# Altium schematic sheet park-contor.SchDoc
size A3
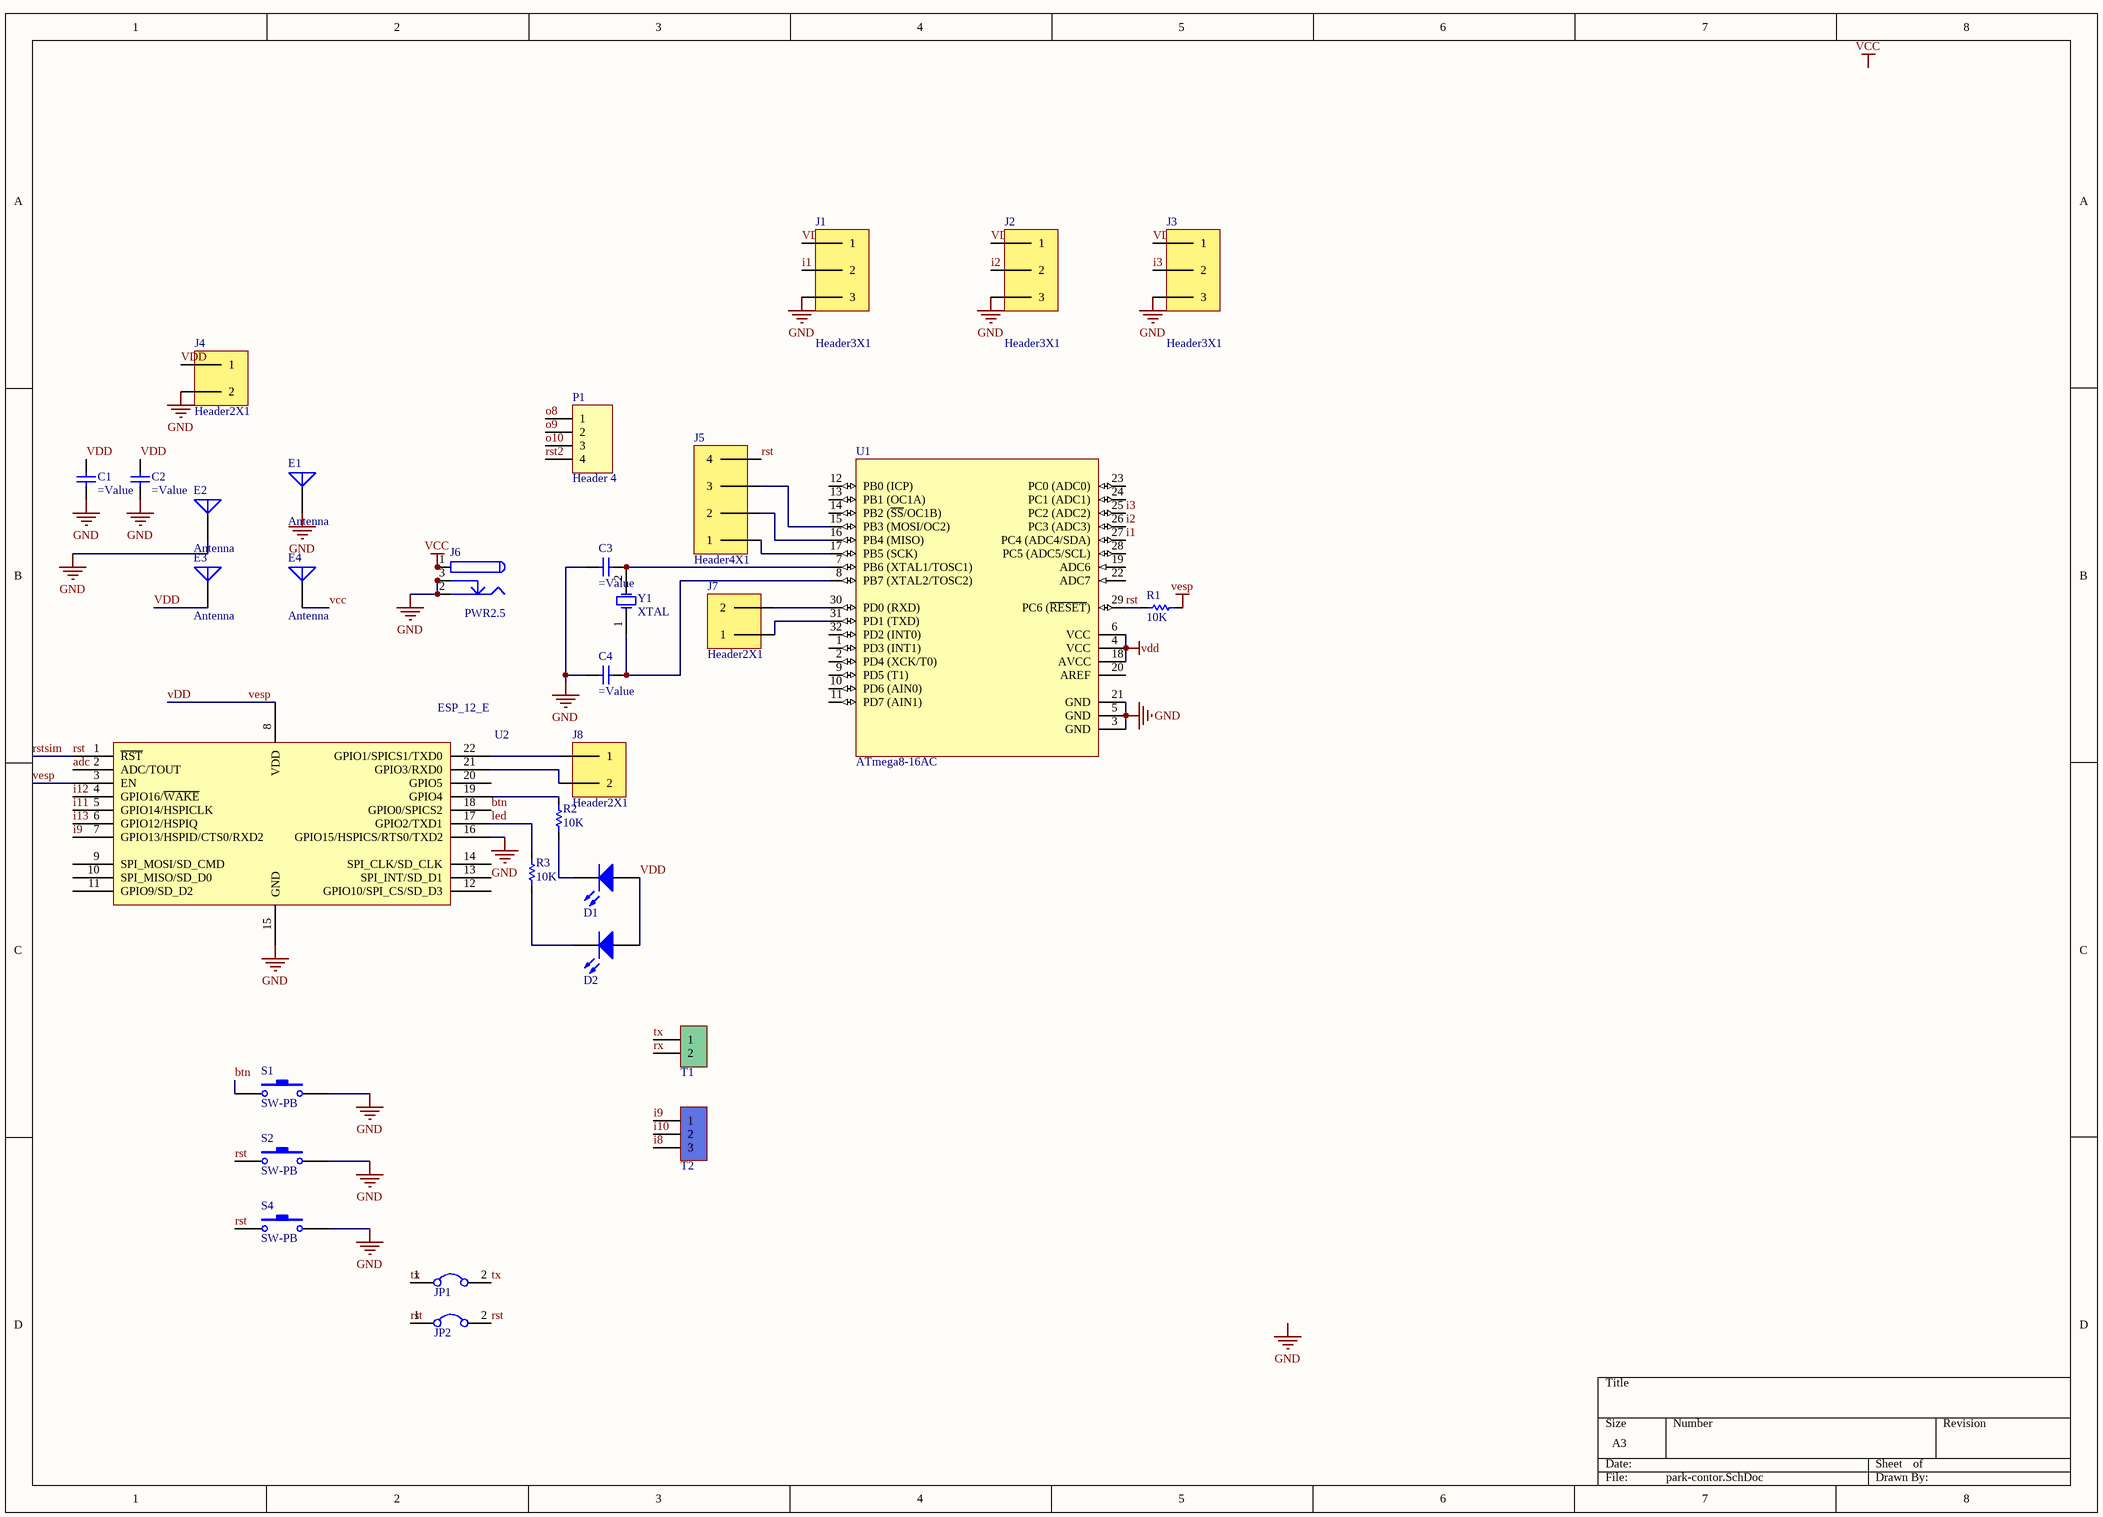
[diagram p0: park-contor.SchDoc]

## Parts
C1  (no value)  [CAP 1206]
C2  (no value)  [CAP 1206]
C3  (no value)  [CAP 1206]
C4  (no value)  [CAP 1206]
D1  LED 5mm  [LED-1]  (value not drawn)
D2  LED 5mm  [LED-1]  (value not drawn)
E1  Antenna  [PIN1]
E2  Antenna  [PIN1]
E3  Antenna  [PIN1]
E4  Antenna  [PIN1]
J1  Header3X1  [HEADER 3X1]
J2  Header3X1  [HEADER 3X1]
J3  Header3X1  [HEADER 3X1]
J4  Header2X1  [Header 2X1]
J5  Header4X1  [HEADER 4X1]
J6  PWR2.5  [KLD-0202]
J7  Header2X1  [Header 2X1]
J8  Header2X1  [Header 2X1]
JP1  Jumper  [Header 2X1]  (value not drawn)
JP2  Jumper  [Header 2X1]  (value not drawn)
P1  Header 4  [HDR1X4]
R1  10K  [RES 1206 (3216X08L)]
R2  10K  [RES 1206 (3216X08L)]
R3  10K  [RES 1206 (3216X08L)]
S1  SW-PB  [SPST-2]
S2  SW-PB  [SPST-2]
S4  SW-PB  [SPST-2]
T1  Phoenix terminal  [phoenix terminal R 2]  (value not drawn)
T2  Terminal  [phoenix terminal R 3]  (value not drawn)
U1  ATmega8-16AC  [32A_N]
U2  ESP_12_E  [ESP_12_E]
Y1  XTAL  [R38]

## Nets
GND: C1.2(-) C2.2(-) C3.2(-) C4.2(-) E1.1(A) E2.1(A) J1.3 J2.3 J3.3 J4.2 J6.2 J6.2A J6.2B J6.3 J6.3A J6.3B S1.2 S2.2 S4.2 U1.3(GND) U1.5(GND) U1.21(GND) U2.15(GND) U2.16(GPIO15/HSPICS/RTS0/TXD2)
vcc: E4.1(A) J6.1 J6.1A J6.1B
vDD: C1.1(+) C2.1(+) D1.1(A) D2.1(A) E3.1(A) J1.1 J2.1 J3.1 J4.1 R1.2 U1.4(VCC) U1.6(VCC) U1.18(AVCC) U2.3(EN) U2.8(VDD)  [also labelled vesp]
adc: U2.2(ADC/TOUT)
btn: S1.1 U2.18(GPIO0/SPICS2)
i1: J1.2 U1.27(PC4_(ADC4/SDA))
i2: J2.2 U1.26(PC3_(ADC3))
i3: J3.2 U1.25(PC2_(ADC2))
i8: T2.3
i9: T2.1 U2.7(GPIO13/HSPID/CTS0/RXD2)
i10: T2.2
i11: U2.5(GPIO14/HSPICLK)
i12: U2.4(GPIO16/~{WAKE})
i13: U2.6(GPIO12/HSPIQ)
led: R3.1 U2.17(GPIO2/TXD1)
o8: P1.1
o9: P1.2
o10: P1.3
rst: J5.4 JP2.1 JP2.2 R1.1 S2.1 S4.1 U1.29(PC6_(~{RESET})) U2.1(~{RST})  [also labelled rstsim]
rst2: P1.4
rx: T1.2
tx: JP1.1 JP1.2 T1.1
NetC3_1: C3.1(+) U1.7(PB6_(XTAL1/TOSC1)) Y1.2(OSC2)
NetC4_1: C4.1(+) U1.8(PB7_(XTAL2/TOSC2)) Y1.1(OSC1)
NetD1_2: D1.2(K) R2.2
NetD2_2: D2.2(K) R3.2
NetJ5_1: J5.1 U1.17(PB5_(SCK))
NetJ5_2: J5.2 U1.16(PB4_(MISO))
NetJ5_3: J5.3 U1.15(PB3_(MOSI/OC2))
NetJ7_1: J7.1 U1.31(PD1_(TXD))
NetJ7_2: J7.2 U1.30(PD0_(RXD))
NetJ8_1: J8.1 U2.22(GPIO1/SPICS1/TXD0)
NetJ8_2: J8.2 U2.21(GPIO3/RXD0)
NetR2_1: R2.1 U2.19(GPIO4)

Not connected (* = marked no-connect by the designer): U1 1(PD3_(INT1)) 2(PD4_(XCK/T0)) 9(PD5_(T1)) 10(PD6_(AIN0)) 11(PD7_(AIN1)) 12(PB0_(ICP)) 13(PB1_(OC1A)) 14(PB2_(~{SS}/OC1B)) 19(ADC6) 20(AREF) 22(ADC7) 23(PC0_(ADC0)) 24(PC1_(ADC1)) 28(PC5_(ADC5/SCL)) 32(PD2_(INT0)); U2 9(SPI_MOSI/SD_CMD) 10(SPI_MISO/SD_D0) 11(GPIO9/SD_D2) 12(GPIO10/SPI_CS/SD_D3) 13(SPI_INT/SD_D1) 14(SPI_CLK/SD_CLK) 20(GPIO5)

## Notes on the sheet
- Labels drawn without touching a wire or pin: GND, VCC

## Library data of the parts
C1-C4 = Capacitor
D1 D2 = LED 5mm: Typical LED; Designer: Seyed Mohsen Ghasemian; Published: 07/31/2012; PackageReference: LED; Publisher: www.picpars.com; PackageDescription: LED; 2 Leads
E1-E4 = Antenna: Generic Antenna; Published: 24-Mar-1999; LatestRevisionDate: 17-Jul-2002; LatestRevisionNote: Re-released for DXP Platform.; PackageReference: PIN1; Publisher: Altium Limited
J6 = PWR2.5: Low Voltage Power Supply Connector; Published: 17-Dec-2003; DatasheetDocument: 09-May-2002; Publisher: Altium Limited; ComponentLink1Description: Manufacturer Link; ComponentLink1URL: http://domino.kycon.com/internet/Products.html
P1 = Header 4: Header, 4-Pin; LatestRevisionDate: 17-Jul-2002; LatestRevisionNote: Re-released for DXP Platform.; Publisher: Altium Limited
R1-R3 = Resistor: Tolerance: 5%; Power: 1/4 W; Value: 10K
S1 S2 S4 = SW-PB: Switch; Published: 24-Mar-1999; LatestRevisionDate: 17-Jul-2002; LatestRevisionNote: Re-released for DXP Platform.; PackageReference: SPST-2; Publisher: Altium Limited; PackageDescription: Switch; 2 Leads
T1 = Phoenix terminal R 2: Right Terminal 2 Pin; Designer: Seyed Mohsen Ghasemain; E-mail: picpars@gmail.com; ComponentLinkURL: www.picpars.com
T2 = Terminal 1*3: Terminal 3 Pin 250VAC 16A; Designer: Seyed Mohsen Ghasemain; E-mail: picpars@gmail.com; ComponentLinkURL: www.picpars.com
U1 = ATmega8-16AC: 8-Bit AVR Microcontroller with 8K Bytes of In-System Programmable Flash Memory; Published: 17-Sep-2003; LatestRevisionDate: 16-Oct-2006; LatestRevisionNote: IPC-7351 Footprint Added.; DatasheetVersion: 2486H-AVR-09/02; PackageVersion: revB, Oct-2001; PackageReference: 32A; Publisher: Altium Limited; PackageDescription: 32-Lead, 7x7x1.0 mm Body, 0.8mm Lead Pitch, Thin Profile Plastic Quad Flat Package (TQFP); Supplier 1: Digi-Key; Supplier Part Number 1: ATMEGA8-16AC-ND; Supplier 2: Mouser; Supplier Part Number 2: 556-ATMEGA8-16AC; Code_JEDEC: MS-026-ABA; ComponentLink1Description: Datasheet; ComponentLink1URL: http://www.atmel.com/dyn/resources/prod_documents/doc2486.pdf; ComponentLink2Description: Atmel.com Home; ComponentLink2URL: http://www.atmel.com
U2 = ESP_12_E: ESP-12 Wi-Fi Module by AI-Thinker; IC: ESP8266-EX; Vendor: Ai-thinker
Y1 = XTAL: Crystal Oscillator; Published: 8-Jun-2000; LatestRevisionDate: 17-Jul-2002; LatestRevisionNote: Re-released for DXP Platform.; PackageReference: R38; Publisher: Altium Limited; PackageDescription: Crystal, Thru-Hole; 2 Leads; Body 3.1 x 8.2 mm (Dia.xH)